# Altium schematic sheet Main.SchDoc
size A
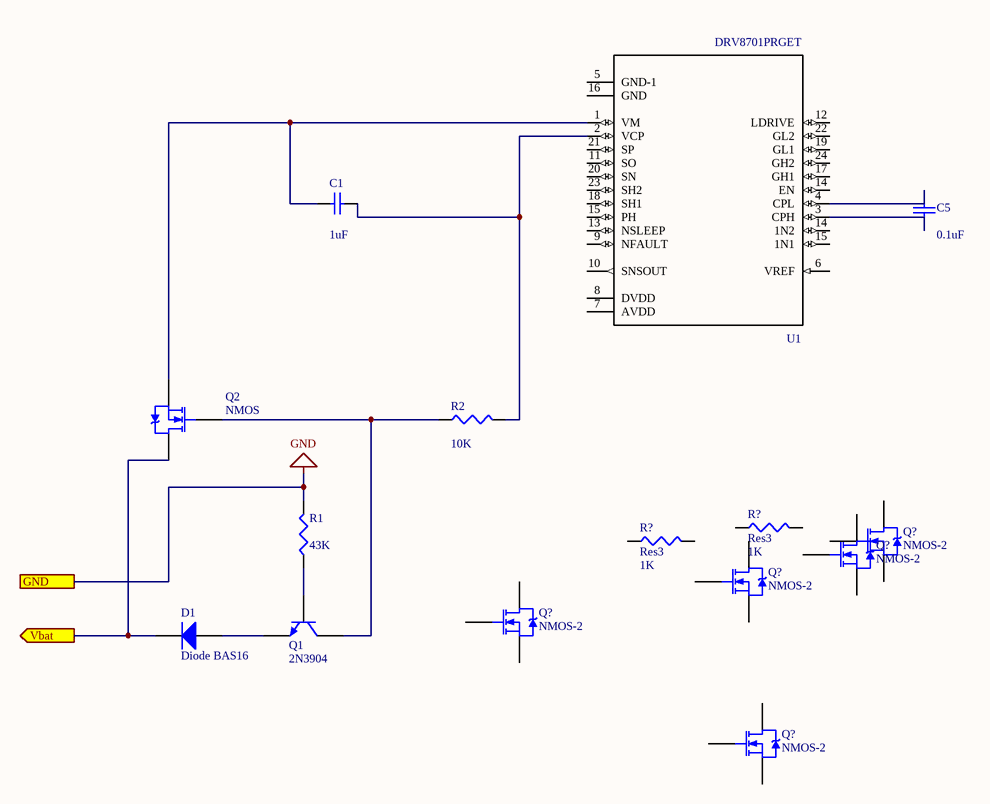
[diagram p0: Main.SchDoc]

## Parts
(Parts that share a designator on the sheet are numbered #1, #2 ... from top to bottom, then left to right.)
C1  value 1uF  [RAD-0.3]
C5  value 0.1uF  [RAD-0.3]
D1  Diode BAS16  [SOT-23_N]
Q1  2N3904  [TO-92A]
Q2  NMOS  [TO-220AB]
Q?#1  NMOS-2  [TO-220AB]
Q?#2  NMOS-2  [TO-220AB]
Q?#3  NMOS-2  [TO-220AB]
Q?#4  NMOS-2  [TO-220AB]
Q?#5  NMOS-2  [TO-220AB]
R1  value 43K  [J1-0603]
R2  value 10K  [J1-0603]
R?#1  Res3  value 1K  [J1-0603]
R?#2  Res3  value 1K  [J1-0603]
U1  DRV8701PRGET  [QFN50P400X400X100-25N]

## Ports
GND, Vbat (out)

## Nets
GND: R1.2 ; port GND
Vbat: D1.3(K) Q2.2(D) ; port Vbat
NetC1_1: C1.1 Q2.3(S) U1.1(VM)
NetC1_2: C1.2 R2.2 U1.2(VCP)
NetC5_1: C5.1 U1.3(CPH)
NetC5_2: C5.2 U1.4(CPL)
NetD1_1: D1.1(A) Q1.1(E)
NetQ1_2: Q1.2(B) R1.1
NetQ1_3: Q1.3(C) Q2.1(G) R2.1

Not connected (* = marked no-connect by the designer): Q?#1 1(G) 2(D) 3(S); Q?#2 1(G) 2(D) 3(S); Q?#3 1(G) 2(D) 3(S); Q?#4 1(G) 2(D) 3(S); Q?#5 1(G) 2(D) 3(S); R?#1 1 2; R?#2 1 2; U1 5(GND-1) 6(VREF) 7(AVDD) 8(DVDD) 9(NFAULT) 10(SNSOUT) 11(SO) 12(LDRIVE) 13(NSLEEP) 14(EN) 15(PH) 16(GND) 17(GH1) 18(SH1) 19(GL1) 20(SN) 21(SP) 22(GL2) 23(SH2) 24(GH2)

## Library data of the parts
C1 C5 = Cap: Capacitor; Published: 8-Jun-2000; LatestRevisionDate: 17-Jul-2002; LatestRevisionNote: Re-released for DXP Platform.; PackageReference: RAD-0.3; Publisher: Altium Limited; PackageDescription: Radial Cap, Thru-Hole; 2 Leads; 0.3 in Pin Spacing
D1 = Diode BAS16: Silicon Switching Diode for High-Speed Switching; Note: Pin 2 is not connected and not drawn.; Published: 21-Mar-2003; LatestRevisionDate: 29-May-2009; LatestRevisionNote: IPC-7351 Footprint Added.; DatasheetVersion: Oct-1999; PackageVersion: Sep-2001; PackageReference: SOT-23; Publisher: Altium Limited; PackageDescription: 3-Pin SOT-23 Package 0.95 mm Pitch, 2.5 mm Lead Span; ComponentLink1Description: Manufacturer Link; ComponentLink1URL: http://www.infineon.com/; ComponentLink2Description: Datasheet; ComponentLink2URL: http://www.infineon.com/upload/Document/cmc_upload/documents/012/5331/bas16series.pdf
Q1 = 2N3904: NPN General Purpose Amplifier; Published: 8-Jun-2000; LatestRevisionDate: 15-Jan-2003; LatestRevisionNote: PCB Footprint 'BCY-W3/D4.7' replaced; DatasheetVersion: 1997; PackageVersion: Sep-1998; PackageReference: TO-92A; Publisher: Altium Limited; PackageDescription: TO, Flat Index; 3 In-Line, Axial Leads; Body Dia. 4.5mm; Leads 0.51 x 0.48 mm (max); ComponentLink1Description: Manufacturer Link; ComponentLink1URL: http://www.fairchildsemi.com/; ComponentLink2Description: Datasheet; ComponentLink2URL: http://www.fairchildsemi.com/ds/2N%2F2N3904.pdf
Q2 Q?#1-Q?#5 = NMOS-2: N-Channel Power MOSFET; Note: Pin 2 is electrically connected to pin 4.; Published: 8-Jun-2000; LatestRevisionDate: 17-Jul-2002; LatestRevisionNote: Re-released for DXP Platform.; DatasheetVersion: PD-9.814; PackageVersion: Feb-1997; PackageReference: TO-220AB; Publisher: Altium Limited; PackageDescription: TO, Thru-Hole, Vertical, Heatsink Mounted; 3 In-Line Leads; Pitch 2.54 mm; ComponentLink1Description: Manufacturer Link; ComponentLink1URL: http://www.irf.com/
R1 R2 R?#1 R?#2 = Res3: Resistor; Published: 8-Jun-2000; LatestRevisionDate: 29-May-2009; LatestRevisionNote: IPC-7351 Footprint Added.; PackageReference: J1-0603; Publisher: Altium Limited; PackageDescription: Chip Resistor
U1 = DRV8701PRGET: Brushed DC Motor Gate Driver _PH/EN, PWM Ctrl_ 24-VQFN -40 to 125; MF: Texas Instruments; SnapEDA_Link: https://www.snapeda.com/parts/DRV8701PRGET/Texas%20Instruments/view-part/?ref=snap; Availability: Unavailable; Price: None; MP: DRV8701PRGET; Package: VQFN-24 Texas Instruments; Value: *